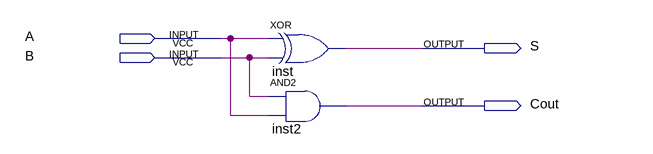
[diagram p0: schematic sheet]
// Quartus schematic Half_adder.bdf as structural Verilog: 2 symbols, 4 pins
module Half_adder (
  input  A,
  input  B,
  output S,
  output Cout
);

  xor inst (S, A, B);
  and inst2 (Cout, B, A);
endmodule
